# EAGLE design mainpcb (EAGLE 6.5.0)
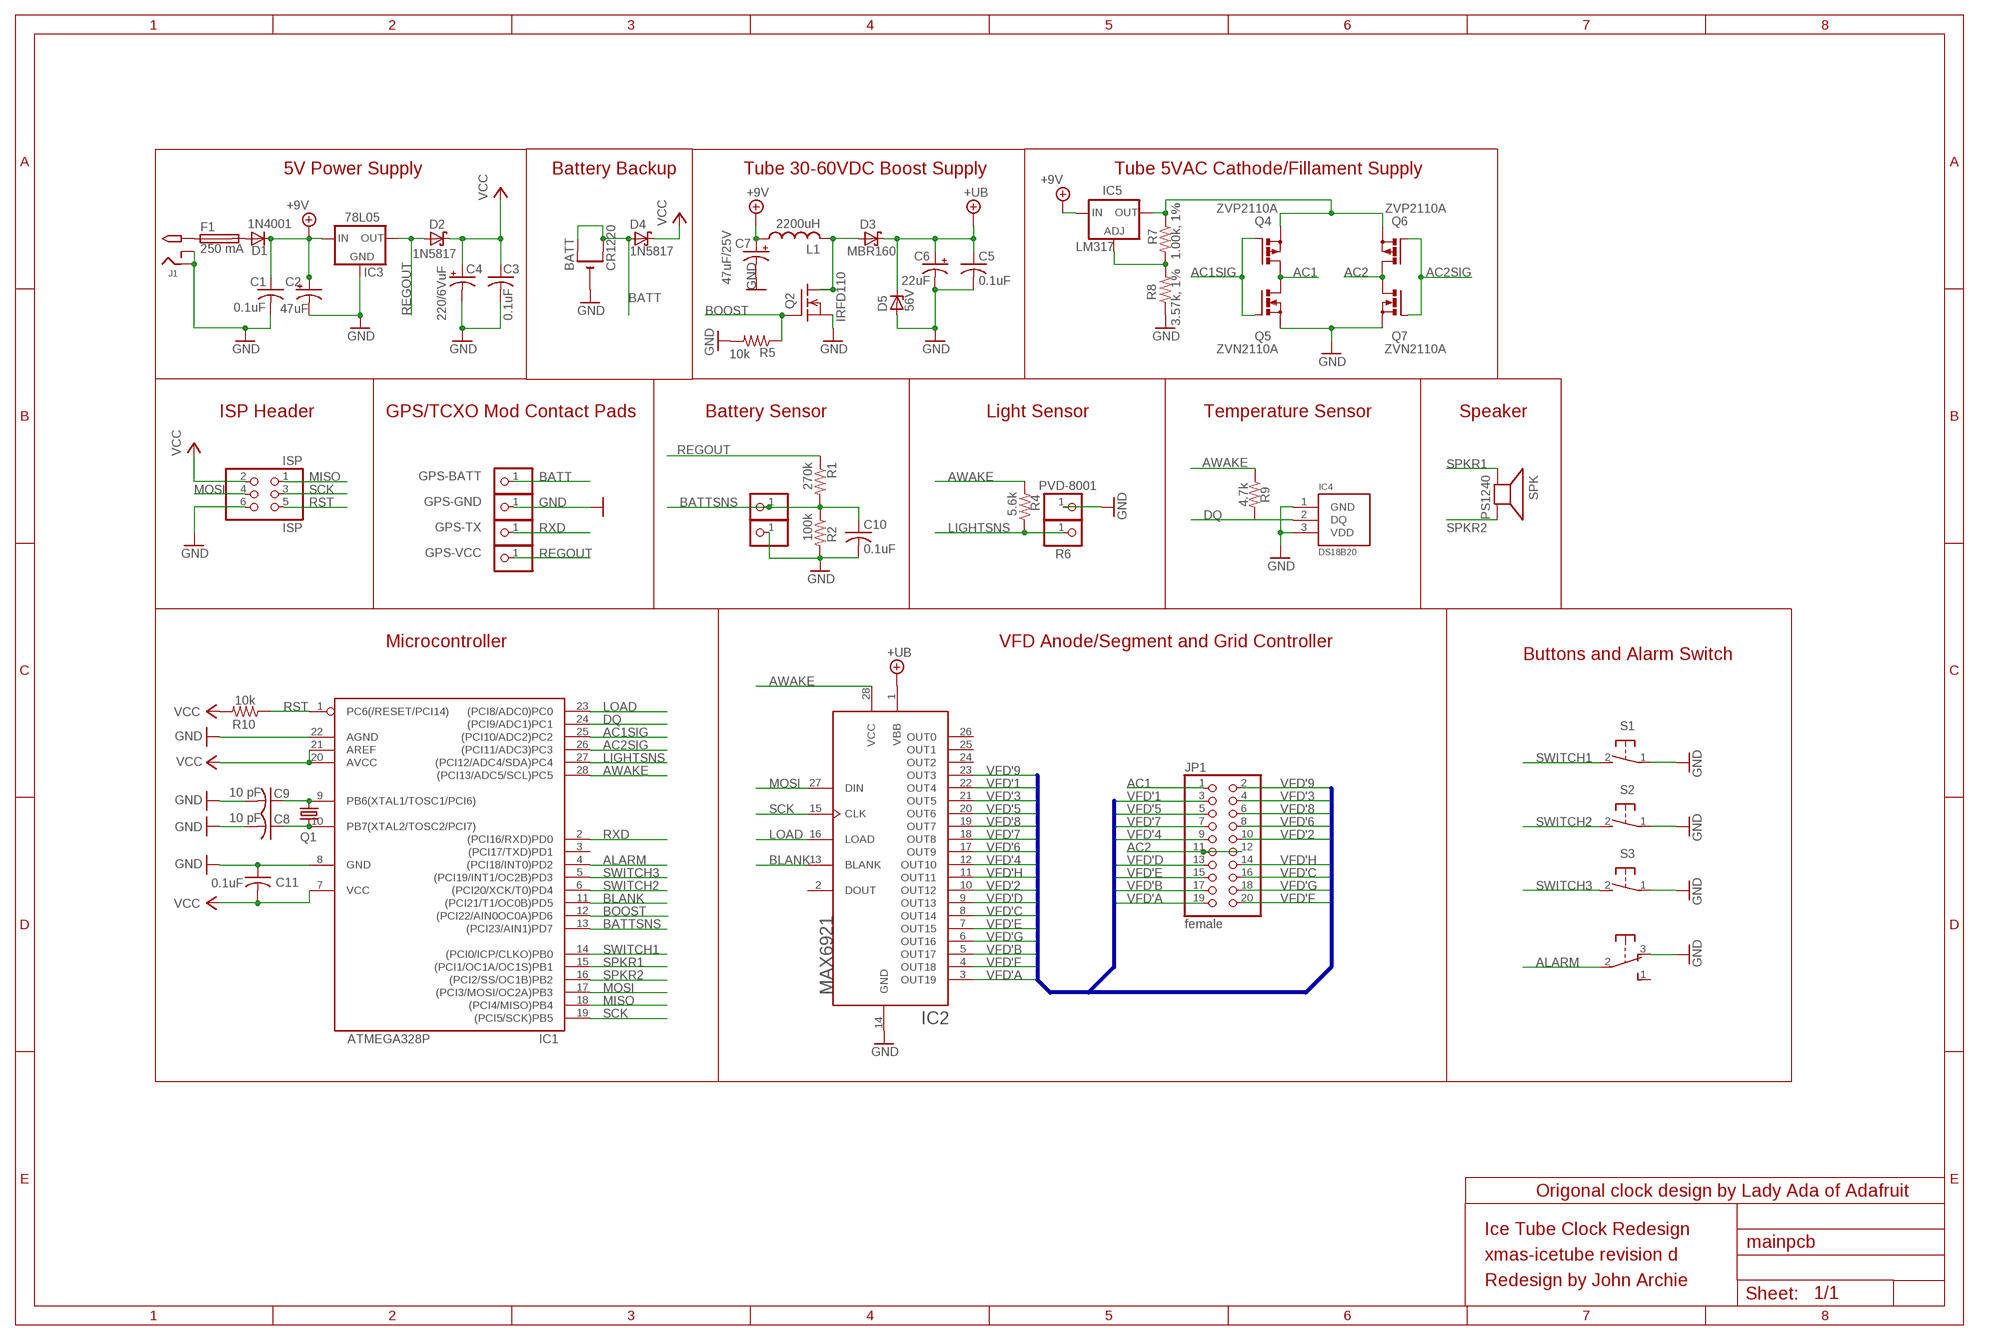
[diagram p0: schematic, sheet 1]

## Parts
BATT  CR1220  CR1220THM  [CR1220-THM]
C1  0.1uF  C-US025-025X050  [C025-025X050]
C2  47uF  CPOL-USE2.5-6  [E2,5-6]
C3  0.1uF  C-US025-025X050  [C025-025X050]
C4  220/6VuF  CPOL-USE2.5-6  [E2,5-6]
C5  0.1uF  C-US025-024X044  [C025-024X044]
C6  22uF  CPOL-USE3.5-8  [E3,5-8]
C7  47uF/25V  CPOL-USE2.5-6  [E2,5-6]
C8  10 pF  C-US025-024X044  [C025-024X044]
C9  10 pF  C-US025-024X044  [C025-024X044]
C10  0.1uF  C-US025-024X044  [C025-024X044]
C11  0.1uF  C-US025-025X050  [C025-025X050]
CT2  PINHD-1X1  [1X01]
CT3  PINHD-1X1  [1X01]
D1  1N4001  1N4004  [DO41-10]
D2  1N5817  SCHOTTKY-DIODEDO41  [DO41-10]
D3  MBR160  SCHOTTKY-DIODEDO41  [DO41-10]
D4  1N5817  SCHOTTKY-DIODEDO41  [DO41-10]
D5  56V  ZENER-DIODEDO41Z10  [DO41Z10]
F1  250 mA  FUSETE5  [TE5]
GPS-BATT  PINHD-1X1  [1X01]
GPS-GND  PINHD-1X1  [1X01]
GPS-TX  PINHD-1X1  [1X01]
GPS-VCC  PINHD-1X1  [1X01]
IC1  ATMEGA328P  ATMEGA168PROUND  [DIL28/3]
IC2  MAX6921  [PLCC-S28]
IC3  78L05  [TO92-LINE]
IC4  DS18B20  [TO92]
IC5  LM317  [TO92-LINE]
ISP  ISP  PINHD-2X3  [2X03]
J1  2.1MMJACK  [PJ-102A]
JP1  female  PINHD-2X10  [2X10]
L1  2200uH  L  [6000]
Q1  32.768 khz  CRYTALTC26V  [TC26V]
Q2  IRFD110  [DIL04]
Q4  ZVP2110A  [TO92-FLAT]
Q5  ZVN2110A  [TO92-FLAT]
Q6  ZVP2110A  [TO92-FLAT]
Q7  ZVN2110A  [TO92-FLAT]
R1  270k  R-US_0207/10  [0207/10]
R2  100k  R-US_0207/10  [0207/10]
R4  5.6k  R-US_0207/5V  [0207/5V]
R5  10k  R-US_0207/5V  [0207/5V]
R6  PVD-8001  PINHD-1X1  [1X01]
R6.1  PINHD-1X1  [1X01]
R7  1.00k, 1%  R-US_0207/5V  [0207/5V]
R8  3.57k, 1%  R-US_0207/5V  [0207/5V]
R9  4.7k  R-US_0207/10  [0207/10]
R10  10k  R-US_0207/5V  [0207/5V]
S1  31-XX  [B3F-31XX]
S2  31-XX  [B3F-31XX]
S3  31-XX  [B3F-31XX]
SPK  PS1240  SPEAKER/PS12  [PS12]
SW1  OS102011MA1Q  [OS102011MA1Q]

## Nets
+9V: C1.1 C2.+ C7.+ D1.C IC3.3(IN) IC5.3(IN) L1.1
+UB: C5.1 C6.+ D3.C D5.C IC2.1(VBB)
AC1: JP1.1 Q4.3(D) Q5.3(D)
AC1SIG: IC1.25((PCI10/ADC2)PC2) Q4.2(G) Q5.2(G)
AC2: JP1.11 JP1.12 Q6.3(D) Q7.3(D)
AC2SIG: IC1.26((PCI11/ADC3)PC3) Q6.2(G) Q7.2(G)
ALARM: IC1.4((PCI18/INT0)PD2) SW1.2(P)
AWAKE: IC1.28((PCI13/ADC5/SCL)PC5) IC2.28(VCC) R4.2 R9.1
BATT: BATT.+1(+) BATT.+2(+1) D4.A GPS-BATT.1
BATTSNS: C10.1 CT2.1 IC1.13((PCI23/AIN1)PD7) R1.2 R2.1
BLANK: IC1.11((PCI21/T1/OC0B)PD5) IC2.13(BLANK)
BOOST: IC1.12((PCI22/AIN0OC0A)PD6) Q2.3(G) R5.1
DQ: IC1.24((PCI9/ADC1)PC1) IC4.2(DQ) R9.2
GND: BATT.- C1.2 C2.- C3.2 C4.- C5.2 C6.- C7.- C8.2 C9.2 C10.2 C11.1 CT3.1 D5.A GPS-GND.1 IC1.8(GND) IC1.22(AGND) IC2.14(GND) IC3.2(GND) IC4.1(GND) IC4.3(VDD) ISP.6 J1.RING J1.RING_SW Q2.4(S) Q5.1(S) Q7.1(S) R2.2 R5.2 R6.1 R8.1 S1.1(P) S2.1(P) S3.1(P) SW1.3(O)
LIGHTSNS: IC1.27((PCI12/ADC4/SDA)PC4) R4.1 R6.1.1
LOAD: IC1.23((PCI8/ADC0)PC0) IC2.16(LOAD)
MISO: IC1.18((PCI4/MISO)PB4) ISP.1
MOSI: IC1.17((PCI3/MOSI/OC2A)PB3) IC2.27(DIN) ISP.4
N$1: C9.1 IC1.9(PB6(XTAL1/TOSC1/PCI6)) Q1.2
N$2: D3.A L1.2 Q2.1(D) Q2.2(D1)
N$3: C8.1 IC1.10(PB7(XTAL2/TOSC2/PCI7)) Q1.1
N$4: F1.1 J1.TIP
N$5: D1.A F1.2
N$6: IC5.1(ADJ) R7.2 R8.2
N$14: IC5.2(OUT) Q4.1(S) Q6.1(S) R7.1
REGOUT: D2.A GPS-VCC.1 IC3.1(OUT) R1.1
RST: IC1.1(PC6(/RESET/PCI14)) ISP.5 R10.1
RXD: GPS-TX.1 IC1.2((PCI16/RXD)PD0)
SCK: IC1.19((PCI5/SCK)PB5) IC2.15(CLK) ISP.3
SPKR1: IC1.15((PCI1/OC1A/OC1S)PB1) SPK.P$1(+)
SPKR2: IC1.16((PCI2/SS/OC1B)PB2) SPK.P$2(-)
SWITCH1: IC1.14((PCI0/ICP/CLKO)PB0) S1.2(S)
SWITCH2: IC1.6((PCI20/XCK/T0)PD4) S2.2(S)
SWITCH3: IC1.5((PCI19/INT1/OC2B)PD3) S3.2(S)
VCC: C3.1 C4.+ C11.2 D2.C D4.C IC1.7(VCC) IC1.20(AVCC) IC1.21(AREF) ISP.2 R10.2
VFD'1: IC2.22(OUT4) JP1.3
VFD'2: IC2.10(OUT12) JP1.10
VFD'3: IC2.21(OUT5) JP1.4
VFD'4: IC2.12(OUT10) JP1.9
VFD'5: IC2.20(OUT6) JP1.5
VFD'6: IC2.17(OUT9) JP1.8
VFD'7: IC2.18(OUT8) JP1.7
VFD'8: IC2.19(OUT7) JP1.6
VFD'9: IC2.23(OUT3) JP1.2
VFD'A: IC2.3(OUT19) JP1.19
VFD'B: IC2.5(OUT17) JP1.17
VFD'C: IC2.8(OUT14) JP1.16
VFD'D: IC2.9(OUT13) JP1.13
VFD'E: IC2.7(OUT15) JP1.15
VFD'F: IC2.4(OUT18) JP1.20
VFD'G: IC2.6(OUT16) JP1.18
VFD'H: IC2.11(OUT11) JP1.14
Unconnected: IC1.3((PCI17/TXD)PD1) IC2.2(DOUT) IC2.24(OUT2) IC2.25(OUT1) IC2.26(OUT0) SW1.1(S) SW1.MT1(MT) SW1.MT2(MT)

## Buses
VFD'[1..9],VFD'_A,VFD'_B,VFD'_C,VFD'_D,VFD'_E,VFD'_F,VFD'_G,VFD'_H

## Notes on the sheet
- 5V Power Supply | Battery Backup | Tube 30-60VDC Boost Supply | Tube 5VAC Cathode/Fillament Supply
- ISP Header | GPS/TCXO Mod Contact Pads | Battery Sensor | Light Sensor | Temperature Sensor | Speaker
- Microcontroller | VFD Anode/Segment and Grid Controller
- Buttons and Alarm Switch
- Origonal clock design by Lady Ada of Adafruit
- Ice Tube Clock Redesign
- xmas-icetube revision d
- Redesign by John Archie

## Library data of the parts
BATT = vfd:CR1220
C1 C3 C11 = minimidi:C-US: CAPACITOR, American symbol
C2 C4 C7 = minimidi:CPOL-US: POLARIZED CAPACITOR, American symbol
C5 C10 = rcl-ez:C-US: CAPACITOR, American symbol
C6 = rcl-ez:CPOL-US: POLARIZED CAPACITOR, American symbol
C8 C9 = resistor:C-US: CAPACITOR, American symbol
CT2 CT3 GPS-BATT GPS-GND GPS-TX GPS-VCC R6 R6.1 = ybox2:PINHD-1X1: PIN HEADER
D1 = minimidi:1N4004: DIODE general purpose rectifier, 1 A
D2-D4 = usbbuck:SCHOTTKY-DIODE: Schottky Diode
D5 = diode:ZENER-DIODE: Z-Diode
F1 = fuse:FUSE: Fuse
IC1 = avr:ATMEGA168*P: MICROCONTROLLER 16 kBytes FLASH 1 kBytes SRAM 512 Bytes EEPROM USART 8-channel 10 bit ADC
IC2 = vfd:MAX6921
IC3 = jarchie:78L05
IC4 = jarchie:DS18B20
IC5 = jarchie:LM317: VOLTAGE REGULATOR
ISP = pinhead-ez:PINHD-2X3: PIN HEADER
J1 = minimidi:2.1MMJACK
JP1 = pinhead:PINHD-2X10: PIN HEADER
L1 = usbbuck:L
Q1 = crystal:CRYTAL: CRYSTAL
Q2 = vfd:IRFD110
Q4 Q6 = jarchie:ZVP2110A
Q5 Q7 = jarchie:ZVN2110A
R1 R2 R4 R5 R7-R10 = minimidi:R-US_: RESISTOR, American symbol
S1-S3 = switch-omron:31-XX: OMRON SWITCH
SPK = ybox2:SPEAKER: SPEAKER Source: Buerklin
SW1 = adaprog:OS102011MA1Q

## Net classes
0 default: clearance 0.205 mm

## Board
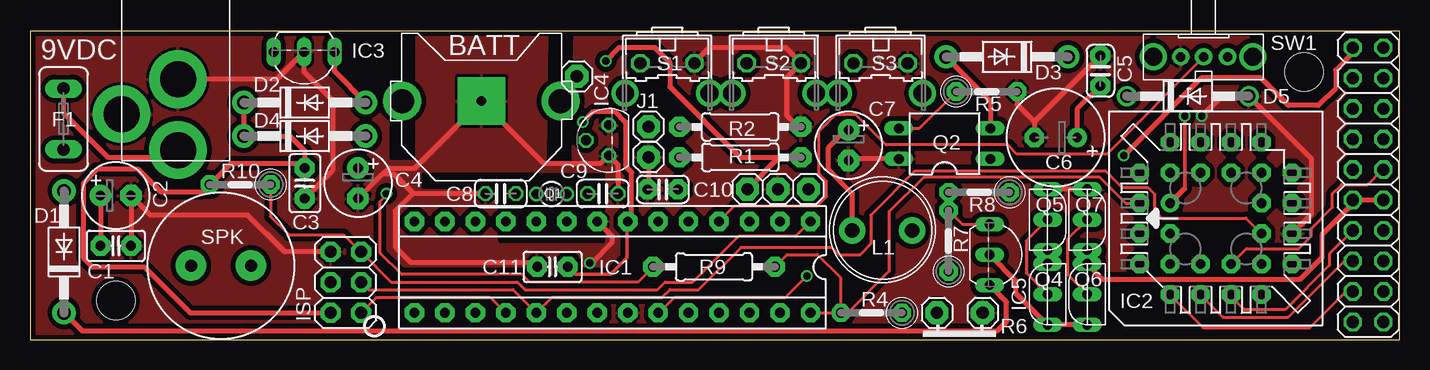
[diagram p1: board, top side]
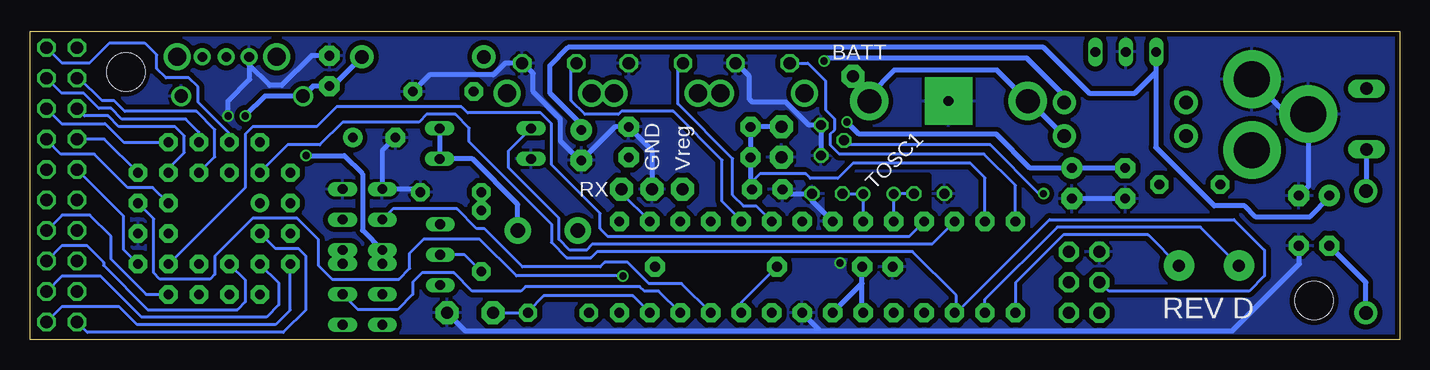
[diagram p2: board, bottom side, seen from below]

Size 114.2 x 25.71 mm. Coordinates in mm from the lower left corner, seen from the top.
Outline: 0,0 114.2,0 114.2,25.71 0,25.71 0,0
Copper layers (1*16): Top 0.0356mm / dielectric 1.5011mm / Bottom 0.0356mm
Design rules "LaenPCBOrder": minimum track width 6mil, minimum drill 13mil, track to track 6mil, track to pad 6mil, pad to pad 6mil, via to via 6mil, smd to smd 6mil, copper to edge 15mil, drill to drill 6mil, minimum pad ring 7mil, minimum via ring 7mil, stop-mask expansion 4mil, vias tented up to drill 0mil, thermal gap 10mil
Holes 3.2 mm at 106.21,22.31 7.15,3.26

### Footprints (pad centres in the part's own frame; a part is rotated, then mirrored left to right if it is on the bottom)
CR1220-THM = drill 2 pad 3.175: +1 -6.604,0; +2 6.604,0 | drill 0.8 pad 3.962 square: - 0,0
C025-025X050 = drill 0.813 pad 1.676 octagon: 1 -1.27,0; 2 1.27,0
E2,5-6 = drill 0.813 pad 1.778: + -1.27,0 | drill 0.813 pad 1.778 octagon: - 1.27,0
C025-024X044 = drill 0.813 pad 1.676 octagon: 1 -1.27,0; 2 1.27,0
E3,5-8 = drill 0.813 pad 1.6: + -1.778,0 | drill 0.813 pad 1.6 octagon: - 1.778,0
C025-024X044' = drill 0.813 octagon: 1 -1.27,0; 2 1.27,0
1X01 = drill 1.016 pad 1.93 octagon: 1 0,0
DO41-10 = drill 1.118 pad 1.93: A 5.08,0; C -5.08,0
DO41Z10 = drill 1.118: A 5.08,0; C -5.08,0
TE5 = drill 1.016 long: 1 -2.54,0; 2 2.54,0
DIL28/3 = drill 0.813 pad 1.6 octagon: 1 -16.51,-3.81; 2 -13.97,-3.81; 3 -11.43,-3.81; 4 -8.89,-3.81; 5 -6.35,-3.81; 6 -3.81,-3.81; 7 -1.27,-3.81; 8 1.27,-3.81; 9 3.81,-3.81; 10 6.35,-3.81; 11 8.89,-3.81; 12 11.43,-3.81; 13 13.97,-3.81; 14 16.51,-3.81; 15 16.51,3.81; 16 13.97,3.81; 17 11.43,3.81; 18 8.89,3.81; 19 6.35,3.81; 20 3.81,3.81; 21 1.27,3.81; 22 -1.27,3.81; 23 -3.81,3.81; 24 -6.35,3.81; 25 -8.89,3.81; 26 -11.43,3.81; 27 -13.97,3.81; 28 -16.51,3.81
PLCC-S28 = drill 0.813 pad 1.524: 1 1.27,3.81 | drill 0.813 pad 1.524 octagon: 2 -1.27,6.35; 3 -1.27,3.81; 4 -3.81,6.35; 5 -6.35,3.81; 6 -3.81,3.81; 7 -6.35,1.27; 8 -3.81,1.27; 9 -6.35,-1.27; 10 -3.81,-1.27; 11 -6.35,-3.81; 12 -3.81,-6.35; 13 -3.81,-3.81; 14 -1.27,-6.35; 15 -1.27,-3.81; 16 1.27,-6.35; 17 1.27,-3.81; 18 3.81,-6.35; 19 6.35,-3.81; 20 3.81,-3.81; 21 6.35,-1.27; 22 3.81,-1.27; 23 6.35,1.27; 24 3.81,1.27; 25 6.35,3.81; 26 3.81,6.35; 27 3.81,3.81; 28 1.27,6.35
TO92-LINE = drill 0.813 long: 1 -2.54,0; 2 0,0; 3 2.54,0
TO92 = drill 0.813 octagon: 1 1.27,0; 2 0,1.905; 3 -1.27,0
2X03 = drill 1.016 pad 1.676 octagon: 1 -2.54,-1.27; 2 -2.54,1.27; 3 0,-1.27; 4 0,1.27; 5 2.54,-1.27; 6 2.54,1.27
PJ-102A = drill 3 pad 4.8: RING 0.1,-3.39; RING_SW -4.6,-6.29; TIP 0.1,-9.29
2X10 = drill 1.016 octagon: 1 -11.43,-1.27; 2 -11.43,1.27; 3 -8.89,-1.27; 4 -8.89,1.27; 5 -6.35,-1.27; 6 -6.35,1.27; 7 -3.81,-1.27; 8 -3.81,1.27; 9 -1.27,-1.27; 10 -1.27,1.27; 11 1.27,-1.27; 12 1.27,1.27; 13 3.81,-1.27; 14 3.81,1.27; 15 6.35,-1.27; 16 6.35,1.27; 17 8.89,-1.27; 18 8.89,1.27; 19 11.43,-1.27; 20 11.43,1.27
6000 = drill 1.2 pad 2.184: 1 -2.5,0; 2 2.5,0
TC26V = drill 0.813: 1 -1.27,0; 2 1.27,0
DIL04 = drill 0.813 long: 1 -1.27,-3.81; 2 1.27,-3.81; 3 1.27,3.81; 4 -1.27,3.81
TO92-FLAT = drill 0.813 long: 1 -2.54,0; 2 0,0; 3 2.54,0
0207/10 = drill 0.813 pad 1.676 octagon: 1 -5.08,0; 2 5.08,0
0207/5V = drill 0.813 pad 1.524 octagon: 1 -2.54,0; 2 2.54,0
B3F-31XX = drill 1.016 octagon: 1 -2.261,-1.245; 2 2.261,-1.245 | drill 1.499 pad 2.159: 3 -3.505,1.245; 4 3.505,1.245
PS12 = drill 1 pad 2.54: P$1 -2.5,0; P$2 2.5,0
OS102011MA1Q = drill 0.8 pad 1.422: 1 -2,0; 2 0,0; 3 1.9,0 | drill 1.5 pad 2.184: MT1 -4.1,0; MT2 4.2,0

### Placement (x,y rotation side)
BATT  37.63,19.9 0 top
C1  7.15,7.84 0 top
C2  10uF/25V  [E2,5-6]  7.15,12.03 0 top
C3  22.9,13.04 270 top
C4  27.35,13.04 270 top
C5  89.24,22.41 90 top
C6  33uF  [E3,5-8]  85.51,16.85 180 top
C7  68.24,16.22 270 top
C8  10 pF  [C025-024X044']  39.24,12.18 180 top
C9  10 pF  [C025-024X044']  47.75,12.18 0 top
C10  52.75,12.53 180 top
C11  43.56,6.08 0 top
CT2  51.56,17.77 0 top
CT3  51.56,15.23 0 top
D1  2.84,7.33 90 top
D2  22.9,19.77 0 top
D3  81.45,23.58 180 top
D4  22.9,16.98 0 top
D5  96.52,20.31 0 top
F1  2.79,18.4 270 top
GPS-BATT  45.59,21.96 0 top
GPS-GND  62.35,12.56 0 top
GPS-TX  64.89,12.56 0 top
GPS-VCC  59.81,12.56 0 top
IC1  48.56,6.06 180 top
IC2  98.85,10.12 90 top
IC3  22.86,23.99 180 top
IC4  48.25,16.62 90 top
IC5  80.01,7.1 270 top
ISP  26.33,4.79 90 top
J1  12.23,25.11 0 top
JP1  111.55,12.92 270 top
L1  71.04,9.11 0 top
Q1  43.48,12.15 0 top
Q2  76.24,16.35 90 top
Q4  84.83,3.8 90 top
Q5  84.83,10.02 270 top
Q6  88.13,3.8 90 top
Q7  88.13,10.02 270 top
R1  59.21,15.2 180 top
R2  59.21,17.74 0 top
R4  70.15,2.25 180 top
R5  79.75,20.69 0 top
R6  79.42,2.25 0 top
R6.1  75.61,2.25 0 top
R7  76.58,8.24 90 top
R8  79.12,12.31 180 top
R9  57.02,6.08 180 top
R10  17.52,12.94 180 top
S1  53.13,21.81 180 top
S2  62.02,21.81 180 top
S3  70.91,21.81 180 top
SPK  15.92,6.19 180 top
SW1  97.83,23.58 180 top

### Tracks (layer width: path | path; a pad name or v marks a point on that pad's centre or on a via)
+9V
  Top 0.406: C2.+ C1.1 | L1.1 68.54,12.22 66.54,14.21 66.54,15.99 68.04,17.49 C7.+ | D1.C 4.33,0.75 80.64,0.75 81.4,1.51 81.4,3.16 IC5.3
  Bottom 0.406: 20.32,22.34 22.09,20.56 25.9,20.56 29.71,24.37 69.34,24.37 70.86,22.85 70.86,20.56 68.24,17.94 C7.+ | D1.C 2.84,4.79 C1.1 | C2.+ 5.88,11.88 7.49,10.27 12.06,10.27 12.95,11.16 15.49,11.16 20.36,16.04 20.32,16.08 20.32,22.34 | 20.32,22.34 IC3.3
+UB  (via drill 0.6)
  Top 0.305: v96.26,18.66 96.26,12.62
  Top 0.406: 96.26,12.62 IC2.1 | C5.1 87.29,19.2 C6.+
  Bottom 0.406: v96.26,18.66 94.61,20.31 D5.C 90.6,21.14 C5.1 88.97,21.14 D3.C
AC1  (via drill 0.6)
  Top 0.406: v91.18,15.35 97.66,21.83 102.61,21.83 104.9,19.55 107.44,19.55 108.83,20.94 108.83,22.47 110.28,23.91 JP1.1 | Q4.3 Q5.3
  Bottom 0.406: v91.18,15.35 88.01,15.35 86.48,13.83 86.48,9.13 Q5.3
AC1SIG
  Top 0.254: Q5.2 83.05,8.24 83.05,5.58 Q4.2
  Bottom 0.254: Q5.2 83.94,10.91 78.61,10.91 76.96,9.26 76.32,9.26 73.15,6.08 66.67,6.08 66.29,6.46 64.38,6.46 62.61,4.69 59.88,4.69 IC1.25
AC2
  Top 0.406: JP1.12 JP1.11 110.28,11.34 107.69,8.75 107.69,6.85 105.91,5.07 89.4,5.07 Q6.3 Q7.3
AC2SIG
  Top 0.254: Q7.2 86.48,8.37 86.48,5.45 Q6.2
  Bottom 0.254: IC1.26 61.79,4.05 62.99,4.05 63.37,4.43 72.89,4.43 73.27,4.05 77.34,4.05 78.86,5.58 81.53,5.58 82.29,4.81 82.29,3.8 83.56,2.53 86.86,2.53 Q6.2
ALARM
  Top 0.254: IC1.4 58.74,11.16 65.65,11.16 66.42,11.93 66.42,13.2 65.78,13.83 65.78,13.96 65.78,14.47 65.78,17.39 67.18,18.78 68.83,18.78 71.37,16.24 81.53,16.24 82.29,15.48 89.78,15.48 97.83,23.53 SW1.2
AWAKE
  Top 0.254: IC2.28 91.33,11.39 89.15,13.58 74.54,13.58 71.62,10.66 71.62,5.7 68.26,2.34 67.6,2.34 67.56,2.3 | 67.56,2.3 67.56,5.19 65.65,7.1 63.11,7.1 R9.1 | IC1.28 R4.2 67.56,2.3
BATT
  Bottom 0.406: D4.A 30.9,19.9 BATT.+1 33.59,22.47 42.16,22.47 44.24,20.39 | 44.24,20.39 BATT.+2 | GPS-BATT.1 44.24,20.61 44.24,20.39
BATTSNS
  Bottom 0.254: IC1.13 34.59,13.5 35.81,14.72 45.59,14.72 46.86,13.45 49.14,13.45 49.52,13.83 53.37,13.83 54.13,13.07 54.13,12.65
  Bottom 0.406: CT2.1 54.1,17.77 R2.1 R1.2 54.13,12.65 C10.1
BLANK
  Bottom 0.254: IC1.11 39.67,9.85 40.89,8.62 66.04,8.62 66.67,9.26 66.67,10.53 70.73,14.59 70.73,14.85 70.73,15.48 70.73,18.02 71.62,18.91 77.72,18.91 78.23,19.42 88.64,19.42 90.29,17.77 95.63,17.77 96.26,17.13 96.26,12.69 102.64,6.31 IC2.13
BOOST
  Top 0.254: Q2.3 74.14,17.62 R5.1
  Bottom 0.254: Q2.3 74.29,15.76 74.29,14.34 70.1,10.15 70.1,8.37 69.21,7.48 67.81,7.48 67.31,7.99 38.98,7.99 37.13,9.85 IC1.12
DQ  (via drill 0.6)
  Top 0.254: R9.2 50.67,4.81 41.65,4.81 41.02,5.45 30.98,5.45 29.21,7.23 29.21,11.54 29.71,12.05 v29.71,12.18
  Bottom 0.254: 46.1,16.37 IC4.2 45.97,16.24 34.16,16.24 30.09,12.18 v29.71,12.18 | R9.2 54.91,3.12 IC1.24
GND  (via drill 0.6)
  Top 0.406: IC2.14 106.8,10.46 106.8,15.1 D5.A 99.34,20.31 v97.69,18.66 | C1.2 C2.- 10.03,10.42 10.03,10.4 18.16,10.4 21.23,7.33 ISP.6 | 37.53,19.8 BATT.- | BATT.- 42.82,14.72 47.62,14.72 IC4.3 49.02,14.59 C9.2 | J1.RING 12.35,21.7 20.57,21.7 IC3.2 22.86,22.34 25.27,19.93 25.27,14.14 C3.2 | BATT.- 32.05,14.31 29.89,14.31 29.37,13.79 | C8.2 31.97,12.18 31.92,12.23 | C5.2 83.73,18.18 | R5.2 82.29,19.63 83.73,18.18 | CT3.1 51.56,12.62 C10.2 | S1.1 55.39,23.12 56.64,24.37 62.99,24.37 64.28,23.08 S2.1 63.11,21.89 63.11,18.66 64,17.77 64.26,17.77 R2.2 | C4.- 29.37,13.79 | 31.92,12.23 30.36,13.79 29.37,13.79 | C11.1 41.9,6.46 31.75,6.46 30.48,7.73 30.48,10.78 31.92,12.23 | IC1.8 48.51,8.65 48.51,8.12 46.79,6.4 v46.67,6.4 | Q2.4 68.37,15.08 C7.- | 83.73,18.18 C6.- | Q7.1 Q5.1
  Bottom 0.406: IC4.3 IC4.1 49.27,17.89 51.18,19.8 53.97,19.8 54.22,20.05 54.22,21.96 55.32,23.05 S1.1 | C5.2 90.73,23.68 93.21,21.2 94.23,21.2 95.93,22.9 SW1.3 95.88,23.53 95.88,21.7 97.69,19.9 v97.69,18.66 | 73.15,23.03 S3.1 | S3.1 74.59,23.05 75.56,22.09 80.89,22.09 R5.2 | J1.RING 9.43,18.82 J1.RING_SW 7.63,12.82 C2.- | IC1.8 49.02,11.6 C9.2 51.25,12.18 C10.2 | GPS-GND.1 62.35,15.81 R2.2 65.45,17.74 C7.- 68.37,14.95 69.97,16.55 69.97,18.4 72.26,20.69 72.26,22.21 73.1,23.05 S3.1 | IC1.22 48.33,0.75 | C3.2 C4.- | 48.33,0.75 13.96,0.75 8.38,6.34 8.38,7.79 C1.2 | C6.- 84.83,15.76 Q5.1 81.91,12.56 R8.1 | R6.1 77.92,0.75 48.33,0.75
  pour Bottom (isolate 0.406, rank 2): -0.01,25.64 -0.01,-0.01 114.17,-0.01 114.17,25.64
  pour Top (isolate 0.406, rank 2): -0.01,25.64 -0.01,-0.01 114.17,-0.01 114.17,25.64
LIGHTSNS
  Bottom 0.254: IC1.27 63.95,3.67 71.37,3.67 72.69,2.35 R4.1 R6.1.1
LOAD  (via drill 0.6)
  Top 0.254: IC1.23 52.42,2.25 53.72,3.54 62.99,3.54 v64.77,5.32
  Bottom 0.254: IC2.16 103.88,10.08 103.88,5.58 103.37,5.07 99.18,5.07 98.8,5.45 98.8,6.97 95.63,10.15 91.94,10.15 90.17,8.37 90.17,6.21 89.02,5.07 83.43,5.07 82.55,5.96 82.55,7.23 81.4,8.37 76.7,8.37 73.66,5.32 v64.77,5.32
MISO
  Top 0.254: IC1.18 39.64,2.25 38.35,3.54 28.9,3.54 ISP.1
MOSI
  Bottom 0.254: ISP.4 24.99,4.79 24.25,4.05 12.57,4.05 11.3,5.32 11.3,7.48 13.84,10.02 29.21,10.02 36.98,2.25 IC1.17 36.98,2.4 36.98,3.7 40.63,7.35 66.92,7.35 67.43,6.85 69.46,6.85 70.73,8.12 70.73,9.64 77.59,16.5 77.59,17.64 78.73,18.78 81.15,18.78 81.78,18.15 88.13,18.15 90.04,16.24 92.73,16.24 IC2.27
N$1
  Bottom 0.254: IC1.9 Q1.2 44.77,12.18 C9.1
N$2
  Top 0.406: D3.A 80.05,19.9 Q2.2
  Bottom 0.406: Q2.2 Q2.1 | 80.03,15.1 Q2.1 | L1.2 73.54,11.3 77.31,15.08 Q2.1
N$3
  Bottom 0.254: IC1.10 Q1.1 42.18,12.18 C8.1
N$4
  Top 0.406: F1.1 2.79,18.91 6.47,15.23 11.74,15.23 J1.TIP
N$5
  Bottom 0.406: F1.2 2.79,12.46 D1.A
N$6
  Top 0.254: R7.2 77.72,9.64 IC5.1
  Bottom 0.254: R8.2 R7.2
N$9
  cutout Top: 30.09,25.64 32,25.64 32,15.1 30.09,15.1
N$14
  Top 0.406: IC5.2 82.16,4.94 82.16,3.92 Q4.1 Q6.1
  Bottom 0.254: R7.1 77.97,7.1 IC5.2
N$18
  cutout Bottom: 39.24,8.24 39.24,13.7 47.75,13.7 47.75,8.24
N$19
  cutout Top: 39.24,13.7 47.75,13.7 47.75,8.24 39.24,8.24
N$21
  cutout Top: 32.76,13.83 42.29,13.83 42.29,12.69 32.76,12.69
N$23
  cutout Top: 43.3,25.64 43.17,14.97 45.08,14.97 45.21,25.64
REGOUT  (via drill 0.6)
  Top 0.406: D2.A 25.39,22.36 IC3.1 | v48,23.23 49.14,24.37 52.06,24.37 53.34,23.1 53.34,21.07 59.2,15.2 R1.1 62.45,15.2 GPS-VCC.1
  Bottom 0.406: D2.A 27.98,20.35 31.11,23.48 47.75,23.48 v48,23.23
RST
  Top 0.254: IC1.1 63.82,8.62 59.05,8.62 55.24,4.81 52.95,4.81 52.32,4.18 41.27,4.18 40.63,4.81 30.12,4.81 ISP.5 27.58,7.33 26.16,8.75 21.59,8.75 20.06,10.27 R10.1
RXD
  Bottom 0.254: IC1.2 64.89,12.23 GPS-TX.1
SCK
  Top 0.254: ISP.3 28.21,4.18 40.28,4.18 IC1.19 43.5,3.54 52.7,3.54 53.34,4.18 55.75,4.18 59.3,7.73 66.8,7.73 67.43,7.1 69.21,7.1 70.1,7.99 70.1,10.4 73.78,14.08 89.66,14.08 89.78,13.96 90.1,13.64 91.05,12.69 93.21,12.69 93.72,12.18 93.72,10.78 94.36,10.15 101.36,10.15 IC2.15
SPKR1
  Bottom 0.254: IC1.15 32.05,4.77 28.06,8.75 20.98,8.75 SPK.P$1
SPKR2
  Bottom 0.254: IC1.16 34.59,3.37 28.57,9.39 16.76,9.39 16.62,9.39 SPK.P$2
SWITCH1
  Bottom 0.254: S1.2 49.35,23.05 47.87,21.58 47.87,19.16 47.11,18.4 47.11,17.51 47.49,17.13 47.49,16.24 46.73,15.48 34.67,15.48 32.05,12.86 IC1.14
SWITCH2
  Bottom 0.254: IC1.6 53.66,11.16 54.73,11.16 55.62,12.05 55.62,15.1 60.19,19.67 60.19,22.62 S2.2
SWITCH3
  Bottom 0.254: IC1.5 54.91,9.94 56.51,11.54 56.51,14.97 60.57,19.04 64.89,19.04 65.14,18.79 67.93,18.79 69.08,19.94 69.08,22.62 S3.2
VCC  (via drill 0.6)
  Top 0.305: 49.78,9.89 49.78,6.85 48.38,5.45 45.46,5.45 C11.2
  Top 0.406: D2.C D4.C 21.71,16.98 22.92,15.77 C3.1 22.9,14.33 22.52,14.71 16.75,14.71 R10.2 14.35,12.31 10.92,12.31 9.01,14.21 5.58,14.21 4.44,13.07 4.44,6.85 5.2,6.08 9.52,6.08 13.35,2.25 ISP.2 | v46.1,18.15 46.98,19.04 48.76,19.04 49.65,18.15 49.65,14.47 50.16,13.96 50.16,10.2 IC1.7 49.8,9.87 49.78,9.89
  Bottom 0.406: v46.1,18.15 45.08,17.13 33.65,17.13 30.83,14.31 C4.+ C3.1 | IC1.20 44.83,2.33 C11.2 44.83,4.71 IC1.21
VFD'1
  Bottom 0.254: 110.21,21.81 JP1.3 110.08,21.81 108.2,19.93 107.18,19.93 106.29,19.04 100.33,19.04 98.8,17.51 98.8,15.25 IC2.22
VFD'2
  Top 0.254: IC2.10 101.41,7.61 105.79,7.61 106.8,8.62 106.8,9.26 108.58,11.04 108.58,12.18 109.34,12.94 111.5,12.94 112.75,14.19 JP1.10
VFD'3
  Bottom 0.254: IC2.21 100.12,17.31 101.21,18.4 106.55,18.4 107.44,19.29 108.45,19.29 109.72,20.56 111.57,20.56 JP1.4
VFD'4
  Bottom 0.254: JP1.9 106.42,10.33 106.42,7.54 IC2.12
VFD'5
  Bottom 0.254: IC2.20 102.66,14.29 101.34,15.61 101.34,17.01 102.1,17.77 106.8,17.77 107.69,18.66 109.67,18.66 JP1.5
VFD'6
  Bottom 0.254: IC2.17 103.95,12.69 106.04,12.69 108.83,15.48 111.63,15.48 112.82,16.67 JP1.8
VFD'7
  Bottom 0.254: IC2.18 107.99,16.73 JP1.7
VFD'8
  Bottom 0.254: JP1.6 111.57,18.02 107.95,18.02 106.4,16.47 IC2.19
VFD'9
  Bottom 0.254: JP1.2 111.57,23.1 109.22,23.1 107.56,24.75 104.64,24.75 103.63,23.74 103.63,22.59 102.87,21.83 100.96,21.83 100.2,21.07 100.2,19.8 97.53,17.13 97.53,16.52 IC2.23
VFD'A
  Bottom 0.254: JP1.19 109.41,0.62 93.09,0.62 91.18,2.53 91.18,6.97 91.82,7.61 93.72,7.61 94.97,8.85 IC2.3
VFD'B
  Top 0.254: IC2.5 97.81,1 106.68,1 109.7,4.03 JP1.17
VFD'C
  Bottom 0.254: JP1.16 111.52,7.86 109.47,7.86 108.07,6.46 108.07,6.21 104.39,2.53 96.9,2.53 96.26,3.16 96.26,5 IC2.8
VFD'D
  Top 0.254: JP1.13 108.33,7.15 108.33,6.21 104.64,2.53 101.21,2.53 100.12,3.62 IC2.9
VFD'E
  Top 0.254: IC2.7 99.46,1.89 104.9,1.89 109.57,6.57 JP1.15
VFD'F
  Bottom 0.254: JP1.20 111.52,2.78 106.8,2.78 105.28,1.26 93.72,1.26 92.5,2.48 IC2.4
VFD'G
  Bottom 0.254: JP1.18 111.52,5.32 108.33,5.32 104.9,1.89 94.48,1.89 93.47,2.91 93.47,4.74 IC2.6
VFD'H
  Bottom 0.254: JP1.14 111.52,10.4 109.22,10.4 107.44,8.62 107.44,6.72 104.52,3.8 102.68,3.8 IC2.11

### Text on the board
tNames: 9VDC | J1
bNames: BATT | Vreg | GND | TOSC1 | RX
_bsilk: REV D